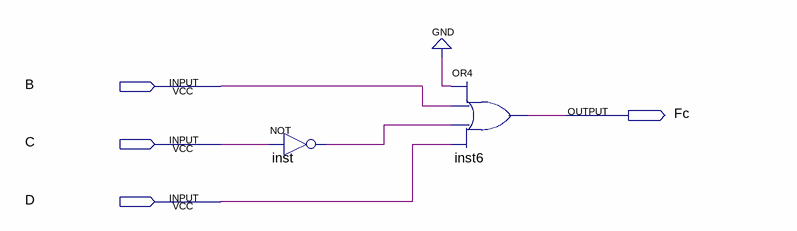
[diagram p0: schematic sheet]
// Quartus schematic Fc.bdf as structural Verilog: 2 symbols, 4 pins
module Fc (
  input  B,
  input  C,
  input  D,
  output Fc
);

  wire inst_out;

  not inst (inst_out, C);
  or inst6 (Fc, 1'b0, B, inst_out, D);
endmodule
